# EAGLE design OmniMotor_MotorOnly (EAGLE 8.3.1)
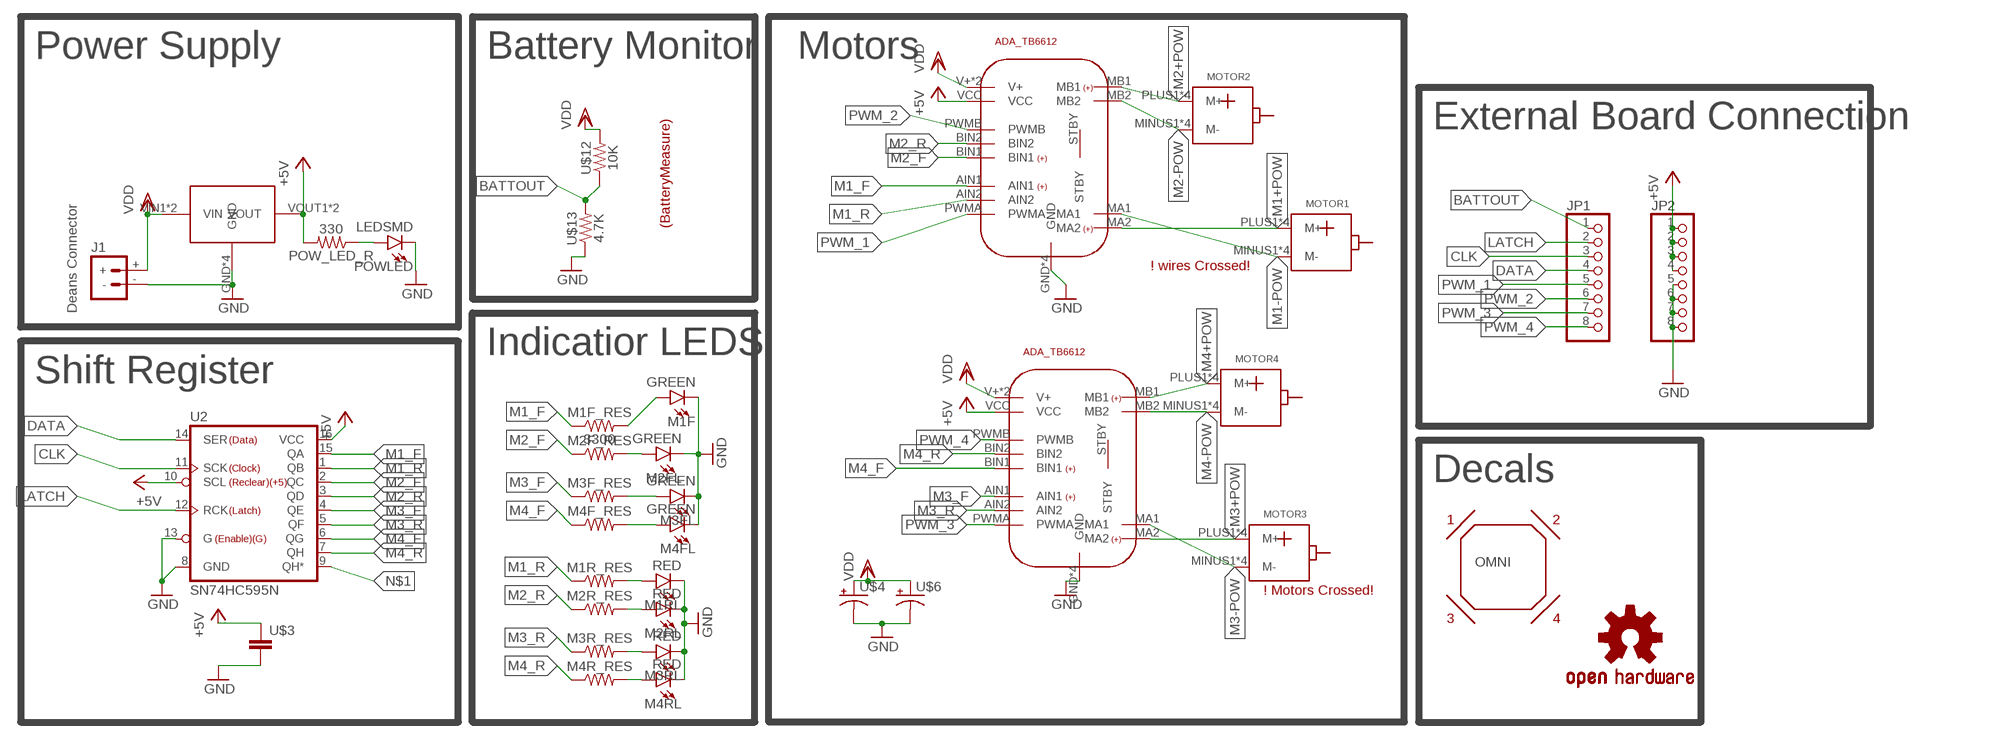
[diagram p0: schematic, sheet 1]

## Parts
J1  BATTERY_CONN_DEANS  [DEANS]
JP1  PINHD-1X8BIG  [1X08-BIG]
JP2  PINHD-1X8BIG  [1X08-BIG]
LOGO1  OSHW-LOGOL  [OSHW-LOGO-L]
M1F  GREEN  LEDSMD  [LED_SMD]
M1F_RES  3300  RESISTORSMD  [R1206]
M1R_RES  RESISTORSMD  [R1206]
M1RL  RED  LEDSMD  [LED_SMD]
M2F_RES  RESISTORSMD  [R1206]
M2FL  GREEN  LEDSMD  [LED_SMD]
M2R_RES  RESISTORSMD  [R1206]
M2RL  RED  LEDSMD  [LED_SMD]
M3F_RES  RESISTORSMD  [R1206]
M3FL  GREEN  LEDSMD  [LED_SMD]
M3R_RES  RESISTORSMD  [R1206]
M3RL  RED  LEDSMD  [LED_SMD]
M4F_RES  RESISTORSMD  [R1206]
M4FL  GREEN  LEDSMD  [LED_SMD]
M4R_RES  RESISTORSMD  [R1206]
M4RL  RED  LEDSMD  [LED_SMD]
MOTOR1  MOTOR_DC  [MOTOR_DC]
MOTOR2  MOTOR_DC  [MOTOR_DC]
MOTOR3  MOTOR_DC  [MOTOR_DC]
MOTOR4  MOTOR_DC  [MOTOR_DC]
OMNI  OMNI  [OMNI]
POW_LED_R  330  RESISTORSMD  [R1206]
POWLED  LEDSMD  [LED_SMD]
U2  SN74HC595N  74HC595N  [DIP16]
U$1  ADA_TB6612  [ADA_TB6612]
U$2  ADA_TB6612  [ADA_TB6612]
U$3  CAP_SMCAP  [C1206]
U$4  CAP_EMED  [CAP_E]
U$5  STEPDOWNGREEN  [STEPDOWN]
U$6  CAP_EMED  [CAP_E]
U$12  10K  RESISTORSMD  [R1206]
U$13  4.7K  RESISTORSMD  [R1206]

## Nets
+5V [pow]: JP2.1 JP2.2 JP2.3 JP2.4 POW_LED_R.2 U2.10(SCL) U2.16(VCC) U$1.VCC U$2.VCC U$3.1 U$5.VOUT1(VOUT) U$5.VOUT2(VOUT)
BATTOUT [motors]: JP1.1 U$12.1 U$13.2
CLK: JP1.3 U2.11(SCK)
DATA: JP1.4 U2.14(SER)
GND [motors]: J1.- JP2.5 JP2.6 JP2.7 JP2.8 M1F.C M1RL.C M2FL.C M2RL.C M3FL.C M3RL.C M4FL.C M4RL.C POWLED.C U2.8(GND) U2.13(G) U$1.GND U$1.GND2(GND) U$1.GND3(GND) U$1.GND4(GND) U$2.GND U$2.GND2(GND) U$2.GND3(GND) U$2.GND4(GND) U$3.2 U$4.- U$5.GND U$5.GND2(GND) U$5.GND3(GND) U$5.GND4(GND) U$6.- U$13.1
LATCH: JP1.2 U2.12(RCK)
M1+POW [motors]: MOTOR1.PLUS1(M+) MOTOR1.PLUS2(M+) MOTOR1.PLUS3(M+) MOTOR1.PLUS4(M+) U$1.MA2
M1-POW [motors]: MOTOR1.MINUS1(M-) MOTOR1.MINUS2(M-) MOTOR1.MINUS3(M-) MOTOR1.MINUS4(M-) U$1.MA1
M1_F: M1F_RES.1 U2.15(QA) U$1.AIN1
M1_R: M1R_RES.1 U2.1(QB) U$1.AIN2
M2+POW [motors]: MOTOR2.PLUS1(M+) MOTOR2.PLUS2(M+) MOTOR2.PLUS3(M+) MOTOR2.PLUS4(M+) U$1.MB1
M2-POW [motors]: MOTOR2.MINUS1(M-) MOTOR2.MINUS2(M-) MOTOR2.MINUS3(M-) MOTOR2.MINUS4(M-) U$1.MB2
M2_F: M2F_RES.1 U2.2(QC) U$1.BIN1
M2_R: M2R_RES.1 U2.3(QD) U$1.BIN2
M3+POW [motors]: MOTOR3.PLUS1(M+) MOTOR3.PLUS2(M+) MOTOR3.PLUS3(M+) MOTOR3.PLUS4(M+) U$2.MA2
M3-POW [motors]: MOTOR3.MINUS1(M-) MOTOR3.MINUS2(M-) MOTOR3.MINUS3(M-) MOTOR3.MINUS4(M-) U$2.MA1
M3_F: M3F_RES.1 U2.4(QE) U$2.AIN1
M3_R: M3R_RES.1 U2.5(QF) U$2.AIN2
M4+POW [motors]: MOTOR4.PLUS1(M+) MOTOR4.PLUS2(M+) MOTOR4.PLUS3(M+) MOTOR4.PLUS4(M+) U$2.MB1
M4-POW [motors]: MOTOR4.MINUS1(M-) MOTOR4.MINUS2(M-) MOTOR4.MINUS3(M-) MOTOR4.MINUS4(M-) U$2.MB2
M4_F: M4F_RES.1 U2.6(QG) U$2.BIN1
M4_R: M4R_RES.1 U2.7(QH) U$2.BIN2
N$1: U2.9(QH*)
N$4: POW_LED_R.1 POWLED.A
N$13: M1F.A M1F_RES.2
N$14: M2F_RES.2 M2FL.A
N$15: M3F_RES.2 M3FL.A
N$16: M1R_RES.2 M1RL.A
N$17: M2R_RES.2 M2RL.A
N$18: M3R_RES.2 M3RL.A
N$19: M4R_RES.2 M4RL.A
N$21: M4F_RES.2 M4FL.A
PWM_1: JP1.5 U$1.PWMA
PWM_2: JP1.6 U$1.PWMB
PWM_3: JP1.7 U$2.PWMA
PWM_4: JP1.8 U$2.PWMB
VDD [motors]: J1.+ U$1.V+ U$1.V+2(V+) U$2.V+ U$2.V+2(V+) U$4.+ U$5.VIN1(VIN) U$5.VIN2(VIN) U$6.+ U$12.2
Unconnected: U$1.STBY U$2.STBY

## Notes on the sheet
- Power Supply | Battery Monitor | Motors
- External Board Connection
- (BatteryMeasure)
- ! wires Crossed!
- Deans Connector
- Indicatior LEDS
- Shift Register
- Decals
- ! Motors Crossed!

## Library data of the parts
J1 = Richard:BATTERY_CONN: Battery Connectors Various footprints for battery connections SparkFun Products: Deans Connector -M/F Pair <https://www.sparkfun.com/products/11864>; SF_ID: PRT-11864
JP1 JP2 = adafruit:PINHD-1X8: PIN HEADER
LOGO1 = SparkFun-Aesthetics:OSHW-LOGO: Open-Source Hardware (OSHW) Logo This logo indicates the piece of hardware it is found on incorporates a OSHW license and/or adheres to the definition of open source hardware found here: http://freedomdefined.org/OSHW
M1F M1RL M2FL M2RL M3FL M3RL M4FL M4RL POWLED = Richard_Components:LED
M1F_RES M1R_RES M2F_RES M2R_RES M3F_RES M3R_RES M4F_RES M4R_RES POW_LED_R U$12 U$13 = Richard_Components:RESISTOR
MOTOR1-MOTOR4 = Richard_Boards:MOTOR_DC
OMNI = Richard:OMNI
U2 = Richard_IC:74*595: 8-Bit Shift Register (Serial to Parallel) Datasheet <http://cdn.sparkfun.com/datasheets/BreakoutBoards/MM74HC595.pdf> SparkFun Products SparkFun Shift Register Breakout - 74HC595 <https://www.sparkfun.com/products/10680> (BOB-10680); PROD_ID: IC-13123
U$1 U$2 = Richard_Boards:ADA_TB6612
U$3 = Richard_Components:CAP_SM
U$4 U$6 = Richard_Components:CAP_E
U$5 = Richard_Boards:STEPDOWN

## Net classes
0 default: width 0.254 mm
1 pow: width 0.762 mm
2 motors: width 0.762 mm

## Board
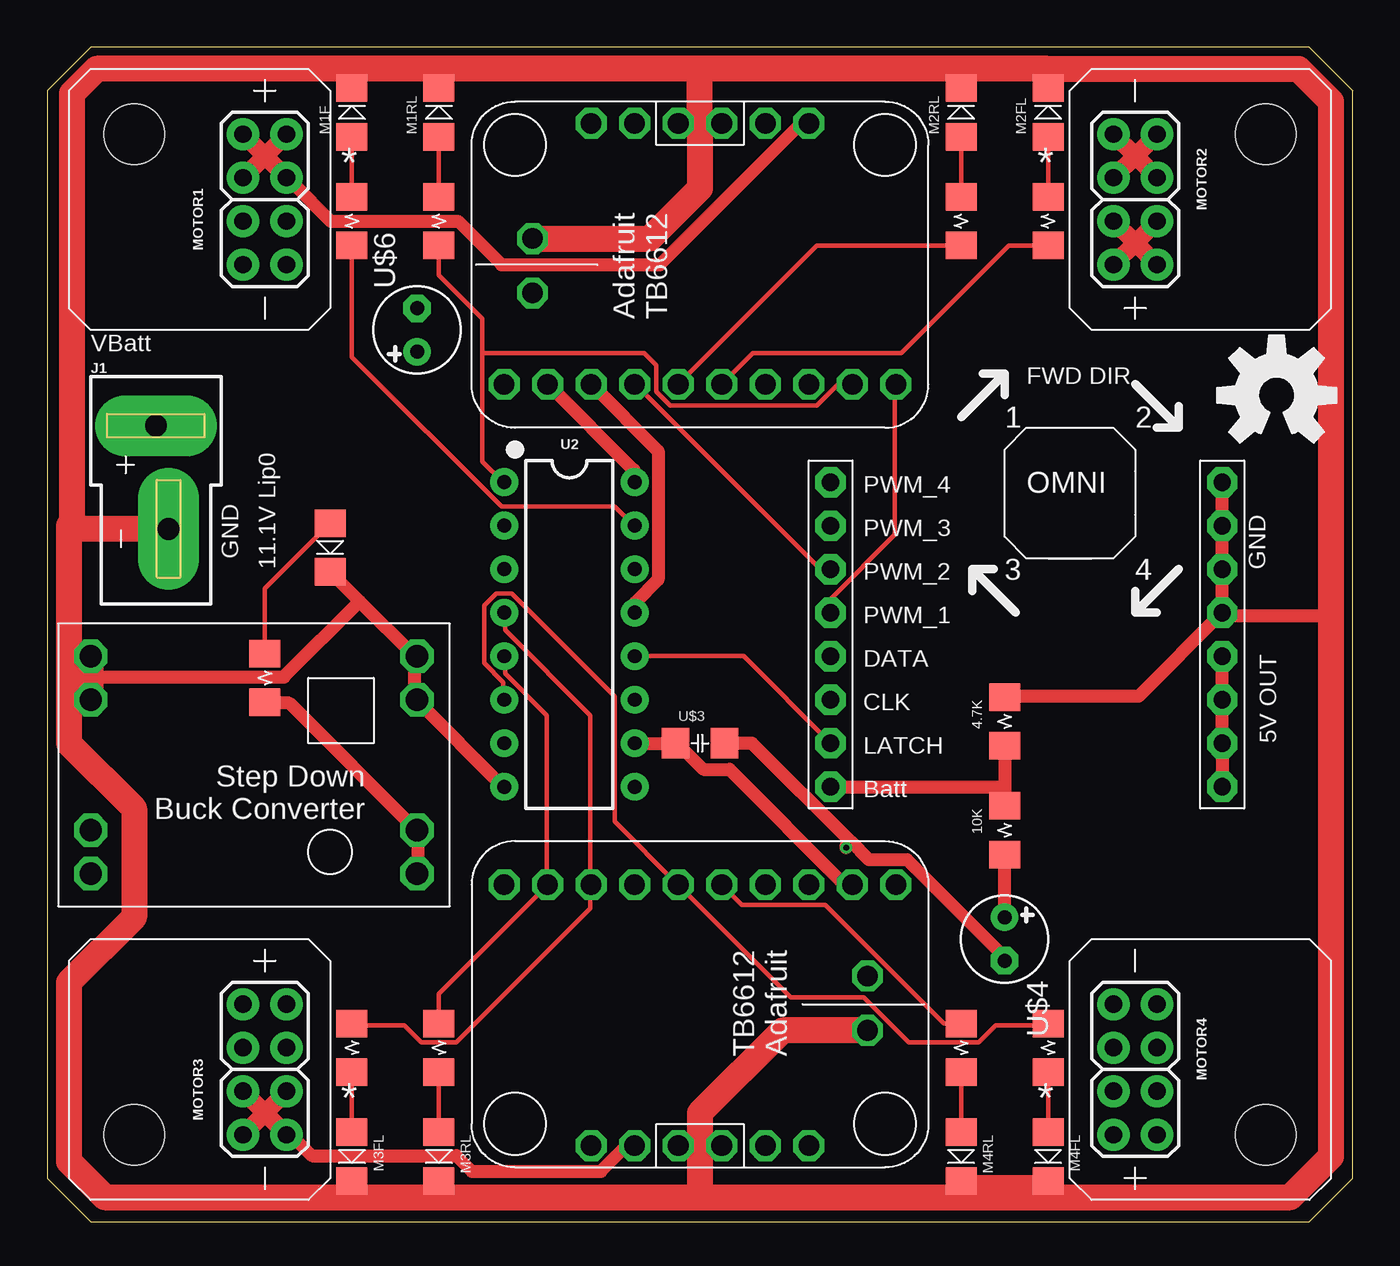
[diagram p1: board, top side]
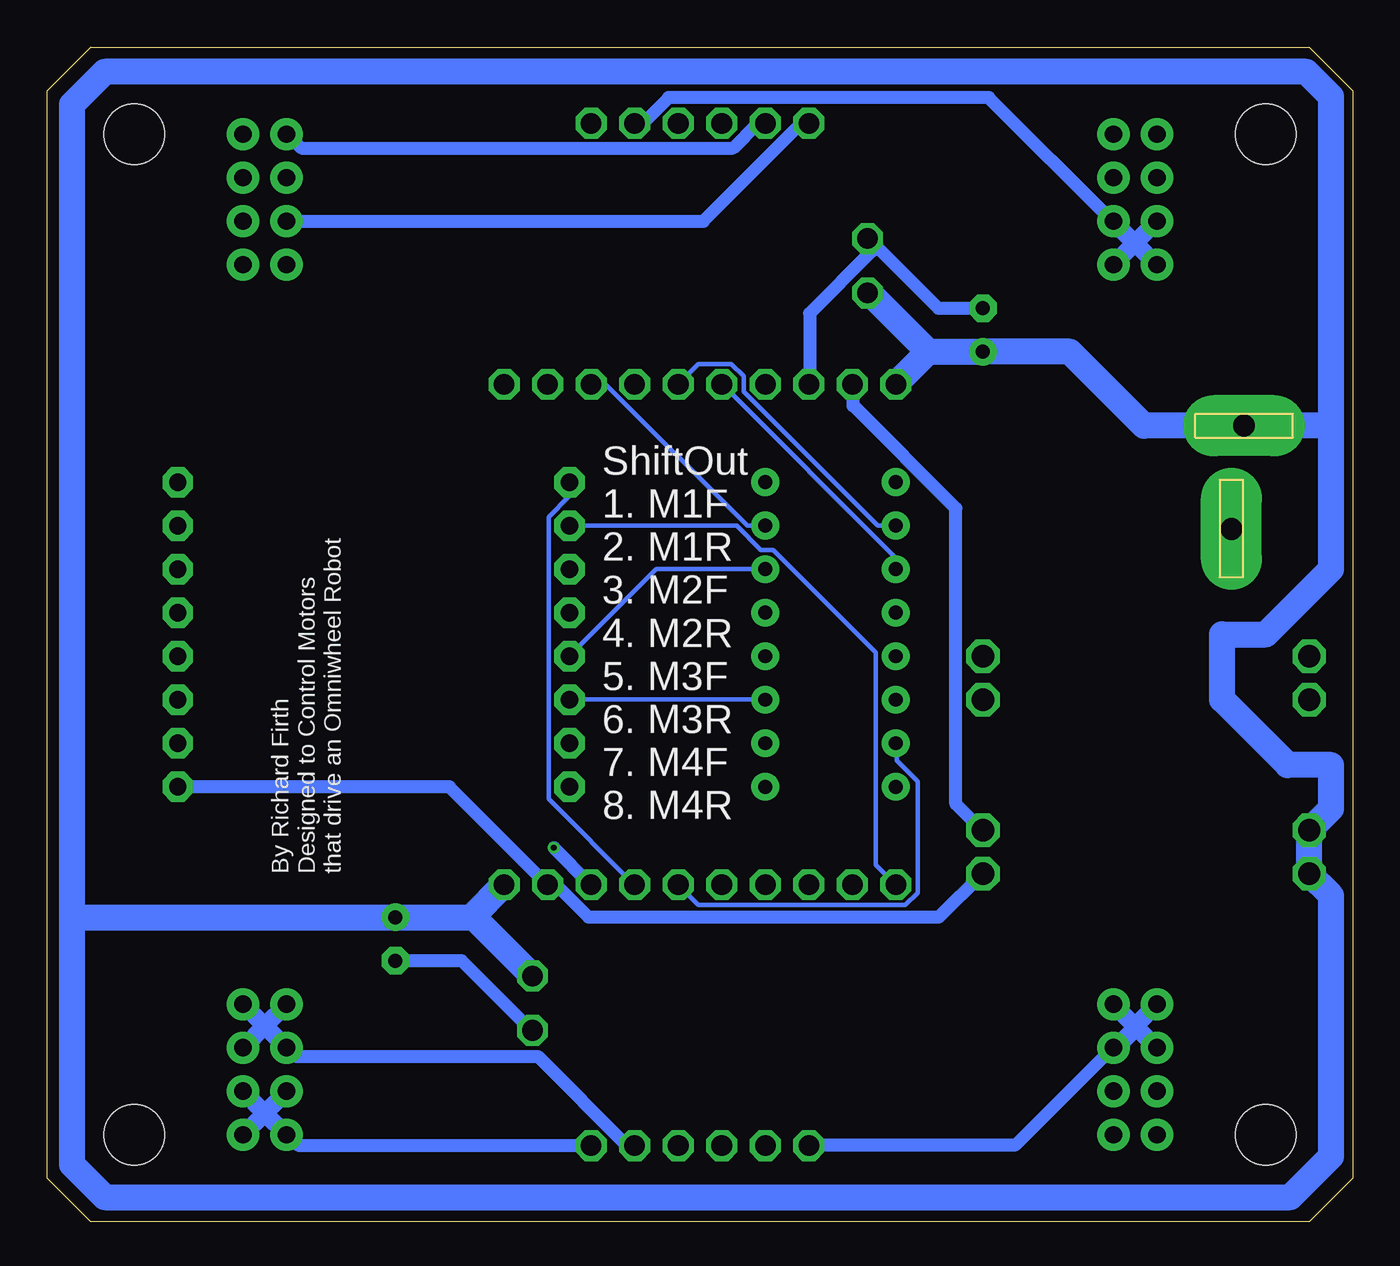
[diagram p2: board, bottom side, seen from below]

Size 76.2 x 68.58 mm. Coordinates in mm from the lower left corner, seen from the top.
Outline: 2.54,0 73.66,0 76.2,2.54 76.2,66.04 73.66,68.58 2.54,68.58 0,66.04 0,2.54 2.54,0
Copper layers (1*16): Top 0.0356mm / dielectric 1.5011mm / Bottom 0.0356mm
Design rules "LaenPCBOrder": minimum track width 6mil, minimum drill 13mil, track to track 6mil, track to pad 6mil, pad to pad 6mil, via to via 6mil, smd to smd 6mil, copper to edge 15mil, drill to drill 6mil, minimum pad ring 7mil, minimum via ring 7mil, stop-mask expansion 3mil, vias tented up to drill 0mil, thermal gap 10mil
Holes 3.5 mm at 5.08,63.5 71.12,63.5 5.08,5.08 71.12,5.08

### Footprints (pad centres in the part's own frame; a part is rotated, then mirrored left to right if it is on the bottom)
DEANS = drill 1.27 pad 3.556 long: + 0,-0.508; - 0.737,-6.54
1X08-BIG = drill 1.016 pad 1.778 octagon: 1 -8.89,0; 2 -6.35,0; 3 -3.81,0; 4 -1.27,0; 5 1.27,0; 6 3.81,0; 7 6.35,0; 8 8.89,0
LED_SMD = smd 1.6 x 1.803: A -1.422,0; C 1.422,0
R1206 = smd 1.6 x 1.803: 1 -1.422,0; 2 1.422,0
MOTOR_DC = drill 1.016 pad 1.88: MINUS1 1.27,7.62; MINUS2 3.81,7.62; MINUS3 1.27,5.08; MINUS4 3.81,5.08; PLUS1 -3.81,7.62; PLUS2 -1.27,7.62; PLUS3 -3.81,5.08; PLUS4 -1.27,5.08
DIP16 = drill 0.813 pad 1.626: 1 -8.89,-3.81; 2 -6.35,-3.81; 3 -3.81,-3.81; 4 -1.27,-3.81; 5 1.27,-3.81; 6 3.81,-3.81; 7 6.35,-3.81; 8 8.89,-3.81; 9 8.89,3.81; 10 6.35,3.81; 11 3.81,3.81; 12 1.27,3.81; 13 -1.27,3.81; 14 -3.81,3.81; 15 -6.35,3.81; 16 -8.89,3.81
ADA_TB6612 = drill 1.2 octagon: AIN1 -6.985,-6.35; AIN2 -6.985,-8.89; BIN1 -6.985,-1.27; BIN2 -6.985,1.27; GND 8.255,-1.27; GND2 8.255,1.27; GND3 -6.985,6.35; GND4 1.524,9.779; MA1 8.255,-3.81; MA2 8.255,-6.35; MB1 8.255,6.35; MB2 8.255,3.81; PWMA -6.985,-11.43; PWMB -6.985,3.81; STBY -6.985,-3.81; V+ -6.985,11.43; V+2 -1.651,9.779; VCC -6.985,8.89
C1206 = smd 1.6 x 1.803: 1 -1.422,0; 2 1.422,0
CAP_E = drill 0.813 pad 1.6: + -1.27,0 | drill 0.813 pad 1.6 octagon: - 1.27,0
STEPDOWN = drill 1.3 octagon: GND -8.89,-6.35; GND2 -8.89,-3.81; GND3 10.16,-3.81; GND4 10.16,-6.35; VIN1 10.16,6.35; VIN2 10.16,3.81; VOUT1 -8.89,3.81; VOUT2 -8.89,6.35

### Placement (x,y rotation side)
J1  6.35,46.99 0 top
JP1  45.72,34.29 90 top
JP2  68.58,34.29 90 top
LOGO1  71.75,48.26 0 top
M1F  17.78,64.77 90 top
M1F_RES  17.78,58.42 90 top
M1R_RES  22.86,58.42 90 top
M1RL  22.86,64.77 90 top
M2F_RES  58.42,58.42 90 top
M2FL  58.42,64.77 90 top
M2R_RES  53.34,58.42 90 top
M2RL  53.34,64.77 90 top
M3F_RES  17.78,10.16 270 top
M3FL  17.78,3.81 270 top
M3R_RES  22.86,10.16 270 top
M3RL  22.86,3.81 270 top
M4F_RES  58.42,10.16 270 top
M4FL  58.42,3.81 270 top
M4R_RES  53.34,10.16 270 top
M4RL  53.34,3.81 270 top
MOTOR1  6.35,59.69 270 top
MOTOR2  69.85,59.69 90 top
MOTOR3  6.35,8.89 270 top
MOTOR4  69.85,8.89 90 top
OMNI  59.69,42.55 0 top
POW_LED_R  12.7,31.75 270 top
POWLED  16.51,39.37 270 top
U2  30.48,34.29 270 top
U$1  38.1,55.88 90 top
U$2  38.1,12.7 270 top
U$3  38.1,27.94 0 top
U$4  55.88,16.51 270 top
U$5  12.7,26.67 180 top
U$6  21.59,52.07 90 top
U$12  55.88,22.86 270 top
U$13  55.88,29.21 270 top

### Tracks (layer width: path | path; a pad name or v marks a point on that pad's centre or on a via)
+5V
  Top 0.762: JP2.1 JP2.2 JP2.3 JP2.4 | U2.10 U$3.1 36.98,27.74 38.3,26.42 39.83,26.42 46.53,19.71 46.94,19.71 U$2.VCC | U2.16 34.24,43.18 34.24,43.89 29.26,48.87 U$1.VCC | POW_LED_R.2 12.7,30.28 14.12,30.28 21.54,22.86 U$5.VOUT1 21.64,22.55 21.64,20.32 U$5.VOUT2
  Bottom 0.762: JP2.1 52.73,25.4 47.04,19.71 U$2.VCC 46.63,19.61 46.43,19.61 44.6,17.78 24.18,17.78 21.64,20.32 U$5.VOUT2 | U$1.VCC 29.16,48.87 29.16,47.65 23.16,41.66 23.16,24.38 21.64,22.86 U$5.VOUT1
BATTOUT
  Top 0.762: U$13.2 55.88,25.4 | 55.88,25.4 U$12.1 | JP1.1 55.88,25.4
CLK
  Bottom 0.254: JP1.3 U2.11
DATA
  Bottom 0.254: U2.14 40.64,38.1 JP1.4
GND  (via drill 0.33)
  Top 0.762: U$3.2 41.15,27.94 46.89,22.2 | 46.89,22.2 47.95,21.13 50.19,21.13 55.88,15.44 U$4.- | v46.63,21.84 46.63,21.95 46.89,22.2 | JP2.5 63.7,30.68 55.88,30.68 U$13.1 | JP2.5 JP2.6 JP2.7 JP2.8 | 18.24,36.22 21.44,33.02 U$5.GND 21.44,32.72 21.44,30.79 U$5.GND2 21.54,30.48 26.62,25.4 U2.8 | 18.24,36.22 16.56,37.9 POWLED.C | U2.13 34.34,35.56 34.34,36.17 35.66,37.49 35.66,45.01 31.8,48.87 U$1.GND3 | 53.34,1.44 M4RL.C 53.65,2.34 58.42,2.34 M4FL.C | 18.24,36.22 13.82,31.8 2.54,31.8 | 74.93,35.36 68.89,35.36 JP2.5 | M3FL.C 17.78,1.44 | M1RL.C 22.86,67.31 | M3RL.C 22.86,1.44 | M1F.C 17.78,67.31
  Top 1.524: 53.42,67.31 38.04,67.31 | 58.38,67.31 53.42,67.31 | 58.38,67.31 73.03,67.31 74.93,65.41 74.93,35.36 74.93,3.81 72.56,1.44 53.34,1.44 38.33,1.44 | 38.04,67.31 22.86,67.31 17.78,67.31 2.89,67.31 1.44,65.87 1.46,65.85 1.46,40.45 | U$5.GND3 2.54,31.8 U$5.GND4 1.27,33.02 | J1.- 1.46,40.45 | 1.46,40.45 1.27,40.64 1.27,33.02 | 1.27,33.02 1.27,27.94 5.08,24.13 5.08,17.78 1.27,13.97 1.27,3.52 3.35,1.44 17.78,1.44 22.86,1.44 38.33,1.44 | U$1.GND4 35.18,57.4 38.1,60.33 38.1,63.97 | 38.1,63.97 38.1,67.25 38.04,67.31 | 37.93,64.14 U$1.GND2 | 37.93,64.14 38.1,63.97 | U$1.GND 37.93,64.14 | M2RL.C 53.34,67.23 53.42,67.31 | M2FL.C 58.42,67.28 58.38,67.31 | 38.1,4.45 U$2.GND | 38.1,4.45 U$2.GND2 | 38.1,4.45 38.1,1.67 38.33,1.44 | U$2.GND4 42.93,11.18 38.1,6.35 38.1,4.45
  Bottom 0.762: v46.63,21.84 44.5,19.71 U$2.GND3 | U$6.- 24.18,53.34 28.25,57.4 U$1.GND4 28.04,56.69 31.7,53.03 31.7,48.97 U$1.GND3 | U$4.- 52.02,15.24 47.95,11.18 U$2.GND4
LATCH
  Top 0.254: U2.12 40.64,33.02 JP1.2
M1+POW
  Top 0.762: U$1.MA2 44.4,64.11 43.99,64.11 35.76,55.88 26.52,55.88 23.98,58.42 16.56,58.42 14.33,60.66 MOTOR1.PLUS2 | 12.78,62.31 12.8,62.28 12.72,62.2
  Top 1.016: MOTOR1.PLUS3 12.72,62.2 MOTOR1.PLUS2 | MOTOR1.PLUS1 12.78,62.31 MOTOR1.PLUS4
M1-POW
  Bottom 0.762: U$1.MA1 41.86,64.21 41.35,64.21 39.93,65.63 21.23,65.63 14.02,58.42 MOTOR1.MINUS1
  Bottom 1.016: MOTOR1.MINUS3 12.72,57.13 | 12.72,57.13 MOTOR1.MINUS2 | MOTOR1.MINUS1 13.97,58.39 12.72,57.13 | 12.72,57.13 12.68,57.13 MOTOR1.MINUS4
M1_F
  Top 0.254: M1F_RES.1 17.78,50.49 26.52,41.76 33.12,41.76 34.24,40.64 U2.15
  Bottom 0.254: U2.15 35.36,40.64 43.59,48.87 44.4,48.87 U$1.AIN1
M1_R
  Top 0.254: M1R_RES.1 22.86,55.27 25.4,52.73 25.4,50.72 | 25.4,50.72 25.4,44.4 26.62,43.18 U2.1 | 25.4,50.72 34.85,50.72 35.56,50.01 35.56,48.46 36.37,47.65 44.91,47.65 46.13,48.87 46.94,48.87 U$1.AIN2
M2+POW
  Top 0.762: 63.58,57.23 63.6,57.2 63.52,57.12
  Top 1.016: MOTOR2.PLUS4 63.58,57.23 MOTOR2.PLUS1 | MOTOR2.PLUS2 63.52,57.12 MOTOR2.PLUS3
  Bottom 0.762: MOTOR2.PLUS2 37.9,58.42 32.21,64.11 31.8,64.11 U$1.MB1
M2-POW
  Top 0.762: 63.58,62.31 63.6,62.28 63.52,62.2
  Top 1.016: MOTOR2.MINUS1 63.58,62.31 MOTOR2.MINUS4 | MOTOR2.MINUS2 63.52,62.2 MOTOR2.MINUS3
  Bottom 0.762: U$1.MB2 34.34,64.11 34.75,64.11 36.17,62.69 61.37,62.69 62.18,63.5 MOTOR2.MINUS2
M2_F
  Top 0.254: M2F_RES.1 56.11,57 49.84,50.72 41.17,50.72 39.42,48.97 U$1.BIN1 | M2F_RES.1
  Bottom 0.254: U2.2 27.74,40.64 35.56,48.46 35.56,49.38 36.27,50.09 38.2,50.09 39.32,48.97 U$1.BIN1
M2_R
  Top 0.254: M2R_RES.1 44.91,57 36.88,48.97 U$1.BIN2 | M2R_RES.1
  Bottom 0.254: U2.3 26.72,38.1 26.72,38.81 36.78,48.87 U$1.BIN2
M3+POW
  Bottom 0.762: U$2.MA2 31.7,4.47 19.71,4.47 14.02,10.16 MOTOR3.PLUS2
  Bottom 1.016: MOTOR3.PLUS1 12.63,11.37 | 12.63,11.37 MOTOR3.PLUS4 | 11.48,12.7 MOTOR3.PLUS3 12.63,11.49 12.63,11.37 | MOTOR3.PLUS2 13.84,10.16 12.63,11.37
M3-POW
  Top 0.762: U$2.MA1 34.24,4.37 33.73,4.37 32.31,2.95 24.79,2.95 23.88,3.86 15.44,3.86 14.43,4.88 MOTOR3.MINUS2 | 12.78,6.43 12.8,6.4 12.72,6.33
  Top 1.016: MOTOR3.MINUS3 12.72,6.33 MOTOR3.MINUS2 | MOTOR3.MINUS1 12.78,6.43 MOTOR3.MINUS4
M3_F
  Top 0.254: M3F_RES.1 17.78,11.48 20.83,11.48 21.84,10.46 23.88,10.46 31.7,18.29 31.7,19.61 U$2.AIN1 31.7,19.71 31.7,29.57 26.72,34.54 26.72,35.56 U2.4
M3_R
  Top 0.254: M3R_RES.1 22.86,13.31 29.16,19.61 U$2.AIN2 29.16,19.71 29.16,29.57 26.72,32 26.72,33.02 U2.5
M4+POW
  Bottom 0.762: U$2.MB1 44.5,4.47 61.57,4.47 62.18,5.08 MOTOR4.PLUS1 | 63.48,6.38 63.5,6.4 63.52,6.38
  Bottom 1.016: MOTOR4.PLUS2 63.48,6.38 MOTOR4.PLUS3 | MOTOR4.PLUS1 63.52,6.38 MOTOR4.PLUS4
M4-POW
  Bottom 0.762: U$2.MB2 41.96,4.47 42.37,4.47 47.55,9.65 61.67,9.65 62.18,10.16 MOTOR4.MINUS1 | 63.48,11.46 63.5,11.48 63.52,11.46
  Bottom 1.016: MOTOR4.MINUS4 63.52,11.46 MOTOR4.MINUS1 | MOTOR4.MINUS2 63.48,11.46 MOTOR4.MINUS3
M4_F
  Top 0.254: M4F_RES.1 58.42,11.48 55.37,11.48 54.36,10.46 50.29,10.46 47.65,13.11 43.38,13.11 36.88,19.61 U$2.BIN1 36.78,19.71 33.12,23.37 33.12,30.68 27.13,36.68 26.21,36.68 25.5,35.97 25.5,32.61 26.62,31.5 26.62,30.48 U2.6
M4_R
  Top 0.254: M4R_RES.1 52.32,11.58 45.41,18.49 40.54,18.49 39.42,19.61 U$2.BIN2 | M4R_RES.1
  Bottom 0.254: U2.7 26.62,27.94 26.62,26.92 25.4,25.7 25.4,19.2 26.11,18.49 38.2,18.49 39.32,19.61 U$2.BIN2
N$4
  Top 0.254: POW_LED_R.1 12.7,36.98 16.46,40.74 POWLED.A
N$13
  Top 0.254: M1F_RES.2 M1F.A
N$14
  Top 0.254: M2FL.A M2F_RES.2
N$15
  Top 0.254: M3FL.A M3F_RES.2
N$16
  Top 0.254: M1RL.A M1R_RES.2
N$17
  Top 0.254: M2RL.A M2R_RES.2
N$18
  Top 0.254: M3R_RES.2 M3RL.A
N$19
  Top 0.254: M4RL.A M4R_RES.2
N$21
  Top 0.254: M4F_RES.2 M4FL.A
PWM_1
  Top 0.254: JP1.5 45.72,36.37 49.48,40.13 49.48,48.87 U$1.PWMA
PWM_2
  Top 0.254: JP1.6 45.11,38.1 34.34,48.87 U$1.PWMB
PWM_3
  Bottom 0.254: JP1.7 35.97,40.64 34.54,39.22 33.83,39.22 27.84,33.22 27.84,20.83 26.72,19.71 U$2.PWMA
PWM_4
  Bottom 0.254: JP1.8 45.72,42.37 46.94,41.15 46.94,24.69 41.96,19.71 U$2.PWMB
VDD
  Top 0.762: U$4.+ U$12.2
  Bottom 1.524: 1.27,46.99 1.78,46.48 J1.+ 12.19,46.48 16.51,50.8 U$6.+ 24.77,50.8 | 1.27,46.99 1.27,65.69 2.71,67.14 72.85,67.14 74.76,65.23 74.76,17.78 | 74.76,17.78 74.76,3.35 72.85,1.44 3.64,1.44 1.27,3.81 1.27,19.05 U$5.VIN1 U$5.VIN2 1.27,24.13 1.27,26.67 3.81,26.67 7.62,30.48 7.62,34.29 5.08,34.29 1.27,38.1 1.27,46.99 | 24.77,50.8 U$1.V+ | U$1.V+2 28.19,54.23 24.77,50.8 | 74.76,17.78 U$4.+ 51.44,17.78 | 51.44,17.78 U$2.V+ | 51.44,17.78 51.31,17.78 U$2.V+2

### Text on the board
tPlace: * | * | VBatt | FWD DIR | PWM_4 | GND | PWM_3 | 11.1V Lip0 | GND | PWM_2 | PWM_1 | DATA | CLK | 5V OUT | LATCH | Batt | * | *
bPlace: ShiftOut / 1. M1F / 2. M1R / 3. M2F / 4. M2R / 5. M3F / 6. M3R / 7. M4F / 8. M4R | By Richard Firth / Designed to Control Motors / that drive an Omniwheel Robot